# EAGLE design wemos_envir (EAGLE 8.1.1)
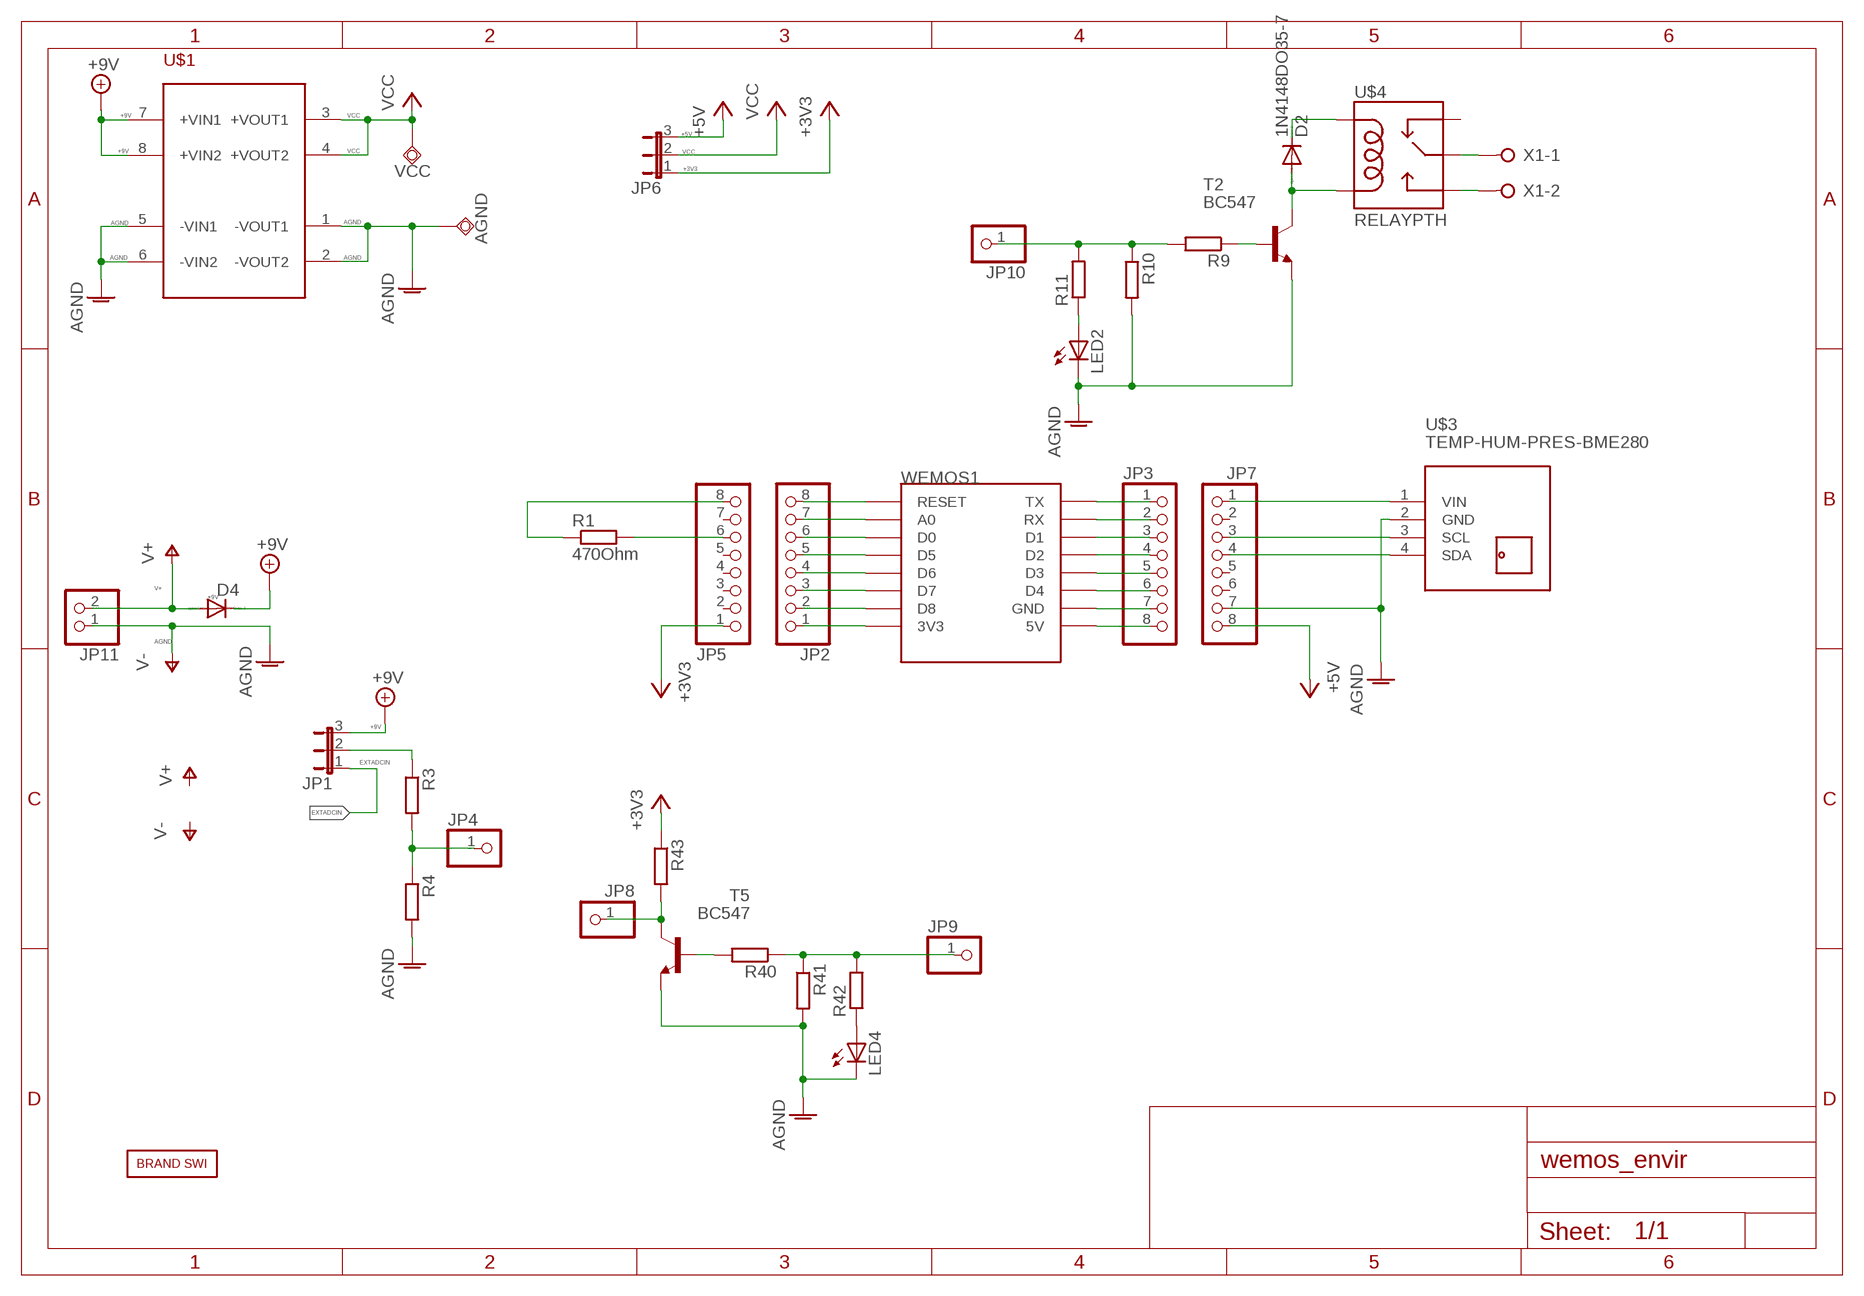
[diagram p0: schematic, sheet 1]

## Parts
AGND  TPSQTP20SQ  [TP20SQ]
D2  1N4148DO35-7  [DO35-7]
D4  1N4148DO35-7  [DO35-7]
JP1  JP2E  [JP2]
JP2  PINHD-1X8  [1X08]
JP3  PINHD-1X8  [1X08]
JP4  PINHD-1X1  [1X01]
JP5  PINHD-1X8  [1X08]
JP6  JP2E  [JP2]
JP7  PINHD-1X8  [1X08]
JP8  PINHD-1X1  [1X01]
JP9  PINHD-1X1  [1X01]
JP10  PINHD-1X1  [1X01]
JP11  PINHD-1X2  [1X02]
LED2  LEDCHIP-LED0805  [CHIP-LED0805]
LED4  LEDCHIP-LED0805  [CHIP-LED0805]
R1  470Ohm  R-EU_R0805  [R0805]
R3  R-EU_R0805  [R0805]
R4  R-EU_R0805  [R0805]
R9  R-EU_R0805  [R0805]
R10  R-EU_R0805  [R0805]
R11  R-EU_R0805  [R0805]
R40  R-EU_R0805  [R0805]
R41  R-EU_R0805  [R0805]
R42  R-EU_R0805  [R0805]
R43  R-EU_R0805  [R0805]
T2  BC547  [TO92]
T5  BC547  [TO92]
U$1  LVPS  [LVPS]
U$2  BRAND_SWI5X7  [BRAND_SWI_5X7]
U$3  TEMP-HUM-PRES-BME280  [TEMP-HUM-PRES-BME280]
U$4  RELAYPTH  [SRD-05VDC-SL-C]
VCC  TPSQTP20SQ  [TP20SQ]
WEMOS1  WEMOS-D1-MINI  [WEMOS-D1-MINI]
X1  W237-02P  [W237-132]

## Nets
+3V3: JP5.1 JP6.1 R43.1
+5V: JP6.3 JP7.8
+9V: D4.C JP1.3 U$1.7(+VIN1) U$1.8(+VIN2)
ADCIN: JP4.1 R3.2 R4.1
AGND: AGND.TP JP7.7 JP11.1 LED2.C LED4.C R4.2 R10.2 R41.2 T2.1(E) T5.1(E) U$1.2(-VOUT2) U$1.5(-VIN1) U$1.6(-VIN2) U$3.2(GND) ; supply symbol labelled V-
EXTADCIN: JP1.1
N$1: JP1.2 R3.1
N$2: JP5.6 R1.2
N$3: D2.C U$4.COIL1
N$4: D2.A T2.3(C) U$4.COIL0
N$5: R9.1 T2.2(B)
N$6: JP10.1 R9.2 R10.1 R11.2
N$7: LED2.A R11.1
N$8: U$4.SWOPEN X1.2
N$9: U$4.SWCOMMON X1.1
N$10: JP5.8 R1.1
N$11: JP2.7 WEMOS1.A0
N$12: JP2.8 WEMOS1.RESET
N$13: JP2.6 WEMOS1.D0
N$14: JP2.5 WEMOS1.D5
N$15: JP2.4 WEMOS1.D6
N$16: JP2.3 WEMOS1.D7
N$17: JP2.2 WEMOS1.D8
N$18: JP2.1 WEMOS1.3V3
N$19: JP3.3 WEMOS1.D1
N$20: JP3.4 WEMOS1.D2
N$21: JP3.1 WEMOS1.TX
N$22: JP3.2 WEMOS1.RX
N$23: JP3.6 WEMOS1.D4
N$24: JP3.7 WEMOS1.GND
N$25: JP3.8 WEMOS1.5V
N$26: JP3.5 WEMOS1.D3
N$27: R40.2 T5.2(B)
N$28: JP7.1 U$3.1(VIN)
N$31: LED4.A R42.1
PCTRL: JP9.1 R40.1 R41.1 R42.2
PVIN: JP8.1 R43.2 T5.3(C)
SCA: JP7.4 U$3.4(SDA)
SCL: JP7.3 U$3.3(SCL)
V+: D4.A JP11.2
VCC: JP6.2 U$1.3(+VOUT1) U$1.4(+VOUT2) VCC.TP
Unconnected: JP5.2 JP5.3 JP5.4 JP5.5 JP5.7 JP7.2 JP7.5 JP7.6 U$1.1(-VOUT1) U$4.SWCLOSED(SWCLOSE)

## Library data of the parts
AGND VCC = testpad:TPSQ: Test pad
D2 D4 = diode:1N4148: DIODE high speed (Philips)
JP1 JP6 = jumper:JP2E: JUMPER
JP2 JP3 JP5 JP7 = pinhead:PINHD-1X8: PIN HEADER
JP4 JP8-JP10 = pinhead:PINHD-1X1: PIN HEADER
JP11 = pinhead:PINHD-1X2: PIN HEADER
LED2 LED4 = led:LED: LED OSRAM: - CHIPLED LG R971, LG N971, LY N971, LG Q971, LY Q971, LO R971, LY R971 LH N974, LH R974 LS Q976, LO Q976, LY Q976 LO Q996 - Hyper CHIPLED LW Q18S LB Q993, LB Q99A, LB R99A - SideLED LS A670, LO A670, LY A670, LG A670, LP A670 LB A673, LV A673, LT A673, LW A673 LH A674 LY A675 LS A676, LA A676, LO A676, LY A676, LW A676 LS A679, LY A679, LG A679 - Hyper Micro SIDELED® LS Y876, LA Y876, LO Y876, LY Y876 LT Y87S - SmartLED LW L88C, LW L88S LB L89C, LB L89S, LG L890 LS L89K, LO L89K, LY L89K LS L896, LA L896, LO L896, LY L896 - TOPLED LS T670, LO T670, LY T670, LG T670, LP T670 LSG T670, LSP T670, LSY T670, LOP T670, LYG T670 LG T671, LOG T671, LSG T671 LB T673, LV T673, LT T673, LW T673 LH T674 LS T676, LA T676, LO T676, LY T676, LB T676, LH T676, LSB T676, LW T676 LB T67C, LV T67C, LT T67C, LS T67K, LO T67K, LY T67K, LW E67C LS E67B, LA E67B, LO E67B, LY E67B, LB E67C, LV E67C, LT E67C LW T67C LS T679, LY T679, LG T679 LS T770, LO T770, LY T770, LG T770, LP T770 LB T773, LV T773, LT T773, LW T773 LH T774 LS E675, LA E675, LY E675, LS T675 LS T776, LA T776, LO T776, LY T776, LB T776 LHGB T686 LT T68C, LB T68C - Hyper Mini TOPLED® LB M676 - Mini TOPLED Santana® LG M470 LS M47K, LO M47K, LY M47K Source: http://www.osram.convergy.de LUXEON: - LUMILED® LXK2-PW12-R00, LXK2-PW12-S00, LXK2-PW14-U00, LXK2-PW14-V00 LXK2-PM12-R00, LXK2-PM12-S00, LXK2-PM14-U00 LXK2-PE12-Q00, LXK2-PE12-R00, LXK2-PE12-S00, LXK2-PE14-T00, LXK2-PE14-U00 LXK2-PB12-K00, LXK2-PB12-L00, LXK2-PB12-M00, LXK2-PB14-N00, LXK2-PB14-P00, LXK2-PB14-Q00 LXK2-PR12-L00, LXK2-PR12-M00, LXK2-PR14-Q00, LXK2-PR14-R00 LXK2-PD12-Q00, LXK2-PD12-R00, LXK2-PD12-S00 LXK2-PH12-R00, LXK2-PH12-S00 LXK2-PL12-P00, LXK2-PL12-Q00, LXK2-PL12-R00 Source: www.luxeon.com KINGBRIGHT: KA-3528ASYC Source: www.kingbright.com
R1 R3 R4 R9-R11 R40-R43 = rcl:R-EU_: RESISTOR, European symbol
T2 T5 = transistor:BC547: NPN TRANSISTOR
U$1 = SWI_COMMONS:LVPS: Low Voltage Power Supply
U$2 = BRAND_SWI:BRAND_SWI
U$3 = diy-modules:TEMP-HUM-PRES-BME280: Digital Humidity-Temperature-Pressure Sensor based on BME280 device More information about BME280 device is available here: https://www.bosch-sensortec.com/bst/products/all_products/bme280 Click here to find device on ebay.com <http://www.ebay.com/sch/bme280+breakout>
U$4 = SWI_COMMONS:RELAY: SPDT relay (COM-00101)
WEMOS1 = SWI_COMMONS:WEMOS-D1-MINI: WeMos.cc D1 mini ESP8266 module
X1 = con-wago-508:W237-02P: WAGO SREW CLAMP; OC_FARNELL: unknown; OC_NEWARK: unknown

## Board
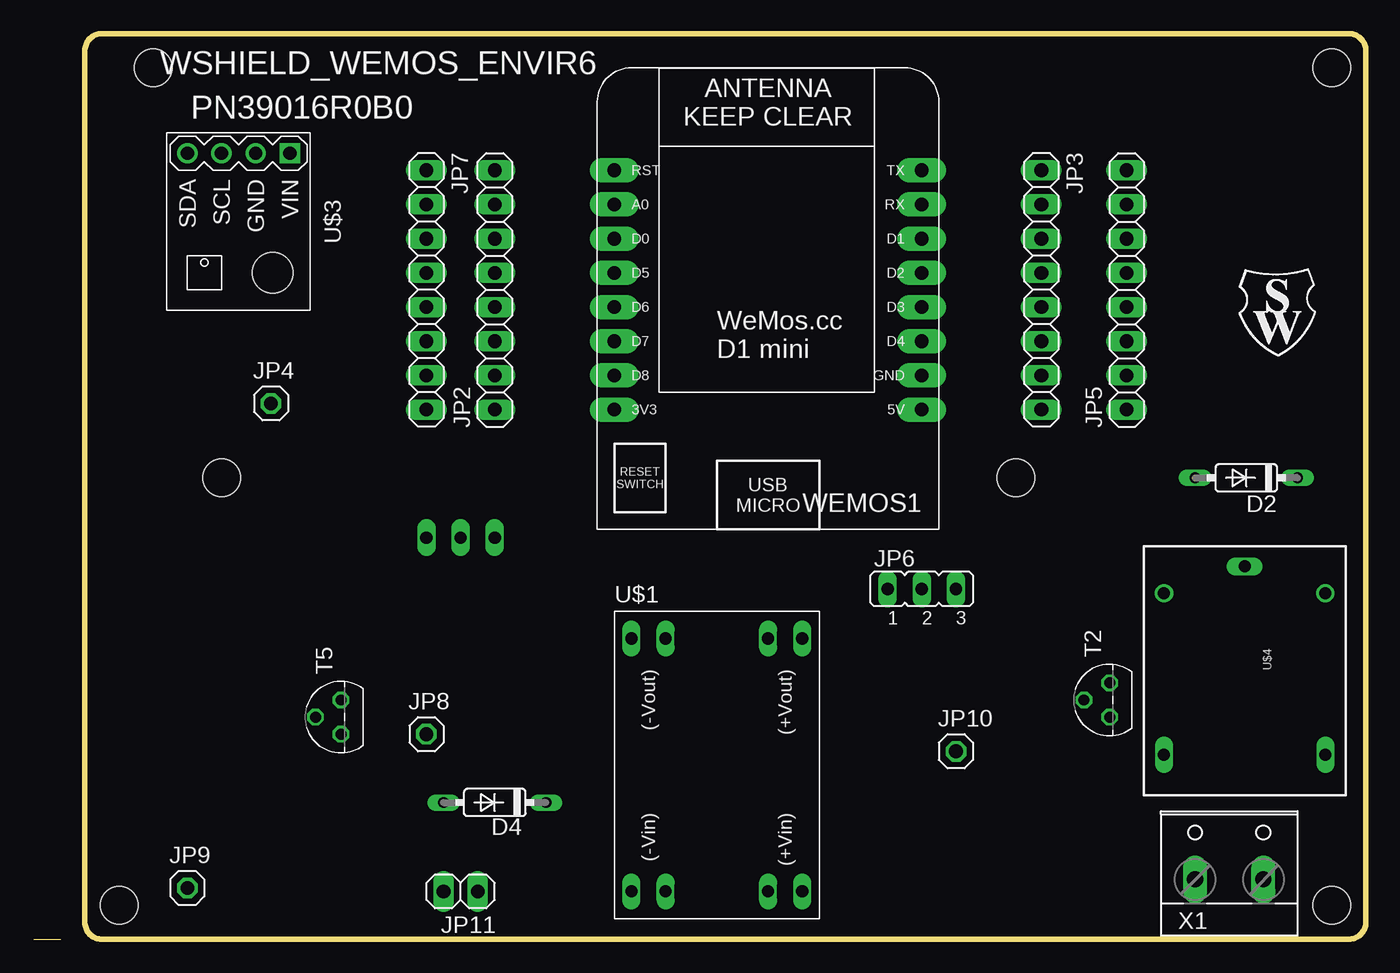
[diagram p1: board, top side]
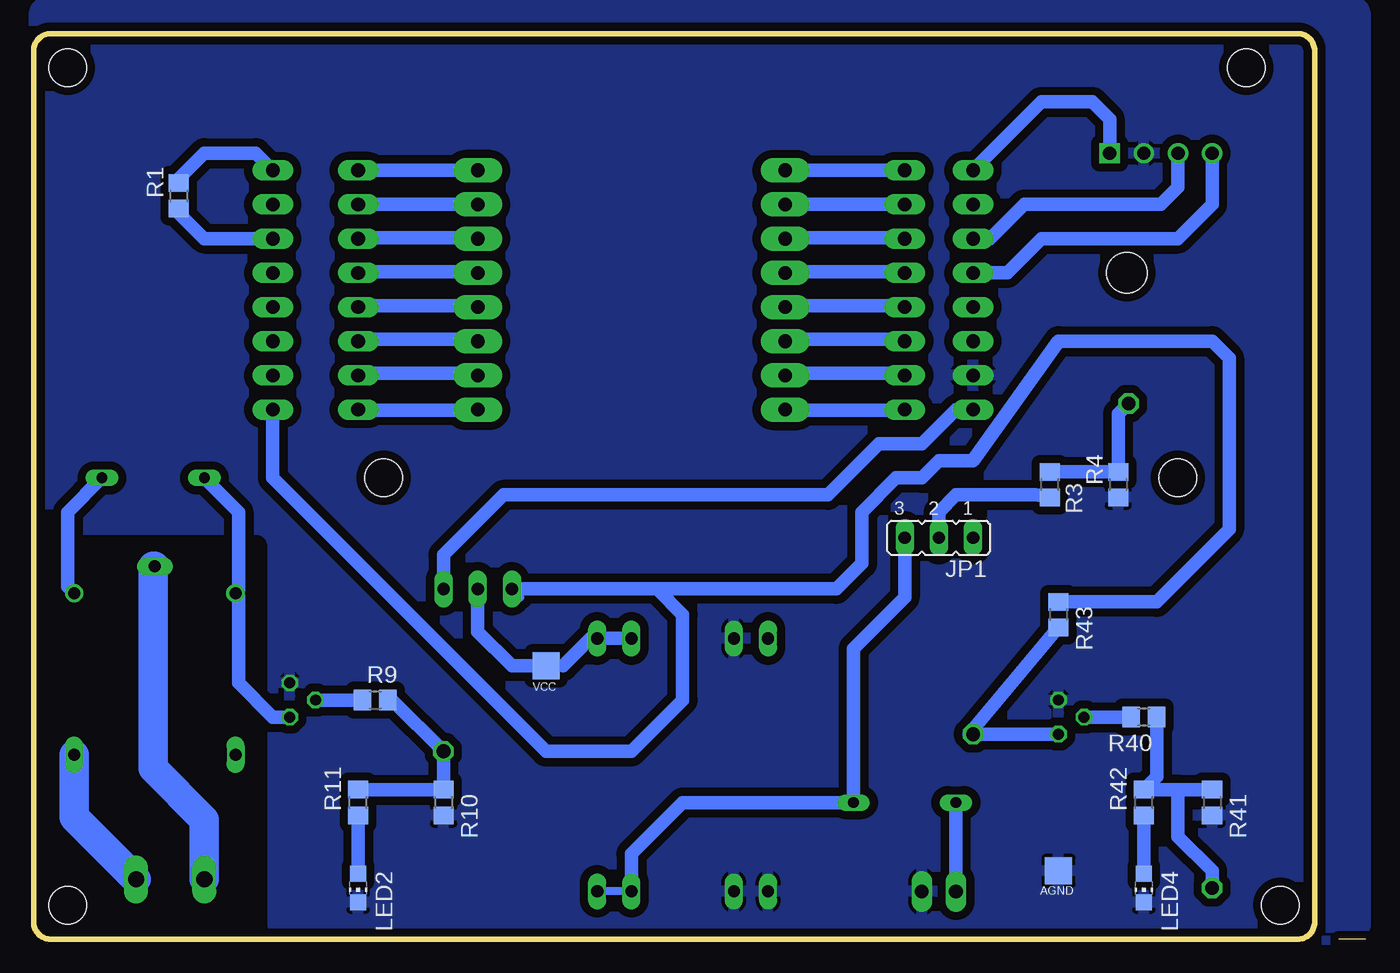
[diagram p2: board, bottom side, seen from below]

Size 99.06 x 67.31 mm. Coordinates in mm from the lower left corner, seen from the top.
Outline: 0,0 2.03,0
Outline: 28.45,0 31.42,0
Outline: 3.81,1.27 3.81,66.04 arc-90 5.08,67.31 97.79,67.31 arc-90 99.06,66.04 99.06,1.27 arc-90 97.79,0 5.08,0 arc-90 3.81,1.27
Copper layers (1*16): Top 0.035mm / dielectric 1.6mm / Bottom 0.035mm
Design rules "Elecrow_2-layer_PCB_eagle_rule *": minimum track width 12mil, minimum drill 12mil, track to track 6mil, track to pad 6mil, pad to pad 6mil, via to via 8mil, smd to smd 0mil, copper to edge 20mil, drill to drill 10mil, minimum pad ring 6mil, minimum via ring 6mil, stop-mask expansion 0mil, vias tented up to drill 100mil, thermal gap 10mil
Holes 2.8 mm at 8.89,64.77 73.03,34.29 6.35,2.54 96.52,64.77 96.52,2.54 13.97,34.29

### Footprints (pad centres in the part's own frame; a part is rotated, then mirrored left to right if it is on the bottom)
TP20SQ = smd 2 x 2: TP 0,0
DO35-7 = drill 0.813 long: A 3.81,0; C -3.81,0
JP2 = drill 0.914 long: 1 -2.54,0; 2 0,0; 3 2.54,0
1X08 = drill 1.016 long: 1 -8.89,0; 2 -6.35,0; 3 -3.81,0; 4 -1.27,0; 5 1.27,0; 6 3.81,0; 7 6.35,0; 8 8.89,0
1X01 = drill 1.016 octagon: 1 0,0
1X02 = drill 1.016 long: 1 -1.27,0; 2 1.27,0
CHIP-LED0805 = smd 1.2 x 1.2: A 0,-1.05; C 0,1.05
R0805 = smd 1.3 x 1.5: 1 -0.95,0; 2 0.95,0
TO92 = drill 0.813 octagon: 1 1.27,0; 2 0,1.905; 3 -1.27,0
LVPS = drill 0.9 long: 1 -6.35,9.4; 2 -3.81,9.4; 3 3.81,9.4; 4 6.35,9.4; 5 -6.35,-9.4; 6 -3.81,-9.4; 7 3.81,-9.4; 8 6.35,-9.4
TEMP-HUM-PRES-BME280 = drill 1 square: 1 -5.08,3.81 | drill 1: 2 -5.08,1.27; 3 -5.08,-1.27; 4 -5.08,-3.81 | hole 3: 3.81,2.54
SRD-05VDC-SL-C = drill 0.9: COIL0 -5.39,-6.12; COIL1 -5.39,5.88 | drill 0.9 long: SWCLOSED 6.61,-6.12; SWCOMMON -7.39,-0.12; SWOPEN 6.61,5.88
WEMOS-D1-MINI = drill 1.016 pad 1.829 long: 3V3 -10.16,-10.16; 5V 12.7,-10.16; A0 -10.16,5.08; D0 -10.16,2.54; D1 12.7,2.54; D2 12.7,0; D3 12.7,-2.54; D4 12.7,-5.08; D5 -10.16,0; D6 -10.16,-2.54; D7 -10.16,-5.08; D8 -10.16,-7.62; GND 12.7,-7.62; RESET -10.16,7.62; RX 12.7,5.08; TX 12.7,7.62
W237-132 = drill 1.194 long: 1 -2.54,-0.635; 2 2.54,-0.635

### Placement (x,y rotation side)
AGND  22.86,5.08 270 bottom
D2  90.17,34.29 180 top
D4  34.29,10.16 180 top
JP1  31.75,29.84 180 bottom
JP2  34.29,48.26 90 top
JP3  74.93,48.26 270 top
JP4  17.65,39.83 0 top
JP5  81.28,48.26 90 top
JP6  66.04,26.04 0 top
JP7  29.21,48.26 270 top
JP8  29.21,15.24 0 top
JP9  11.43,3.81 0 top
JP10  68.58,13.97 0 top
JP11  31.75,3.56 180 top
LED2  74.93,3.81 180 bottom
LED4  16.51,3.81 180 bottom
R1  88.27,55.24 270 bottom
R3  23.5,33.78 90 bottom
R4  18.41,33.78 270 bottom
R9  73.66,17.78 0 bottom
R10  68.58,10.16 270 bottom
R11  74.93,10.16 90 bottom
R40  16.51,16.51 180 bottom
R41  11.43,10.16 270 bottom
R42  16.51,10.16 90 bottom
R43  22.86,24.13 270 bottom
T2  80.01,17.78 90 top
T5  22.86,16.51 90 top
U$1  50.8,12.95 0 top
U$2  89.41,43.18 0 top
U$3  15.24,53.34 270 top
U$4  90.17,20.32 270 top
VCC  60.96,20.32 270 bottom
WEMOS1  53.34,49.53 0 top
X1  88.9,5.08 0 top

### Tracks (layer width: path | path; a pad name or v marks a point on that pad's centre or on a via)
+3V3
  Bottom 0.61: 62.87,25.4 JP6.1
  Bottom 1.016: JP5.1 81.28,34.29 60.96,13.97 54.61,13.97 50.8,17.78 50.8,24.13 52.7,26.04 | 52.7,26.04 JP6.1 | R43.1 15.56,25.08 10.16,30.48 10.16,43.18 11.43,44.45 22.86,44.45 29.21,35.56 31.75,35.56 33.02,34.29 34.92,34.29 37.47,31.75 37.47,27.94 39.37,26.04 52.7,26.04
+5V
  Bottom 1.016: JP7.8 30.48,39.37 33.02,36.83 36.2,36.83 40.01,33.02 64.14,33.02 68.58,28.57 JP6.3
+9V
  Bottom 0.61: U$1.7 U$1.8
  Bottom 1.016: JP1.3 34.29,25.4 38.1,21.59 D4.C 50.8,10.16 54.61,6.35 U$1.7
ADCIN
  Bottom 1.016: R3.2 R4.1 18.41,39.06 JP4.1
AGND
  pour Bottom (isolate 0.61): 0,68.58 arc-90 1.27,69.85 3.81,69.85 97.79,69.85 arc-90 99.06,68.58 99.06,66.04 99.06,31.75 arc-90 97.79,30.48 96.52,30.48 82.55,30.48 arc90 81.28,29.21 81.28,1.27 arc-90 80.01,0 77.47,0 1.27,0 arc-90 0,1.27
N$1
  Bottom 1.016: JP1.2 31.75,31.75 30.48,33.02 24.58,33.02 R3.1
N$2
  Bottom 0.61: R1.2 88.27,53.98
  Bottom 1.016: 88.27,53.98 86.36,52.07 JP5.6
N$3
  Bottom 1.016: D2.C 96.52,31.75 96.52,26.18 U$4.COIL1
N$4
  Bottom 0.61: 83.82,25.94 U$4.COIL0 83.82,25.48
  Bottom 1.016: D2.A 83.82,31.75 83.82,25.94 | T2.3 81.28,16.51 83.82,19.05 83.82,25.48
N$5
  Bottom 1.016: T2.2 R9.1
N$6
  Bottom 1.016: R9.2 72.39,17.78 JP10.1 R10.1 R11.2
N$7
  Bottom 1.016: R11.1 LED2.A
N$8
  Bottom 2.184: U$4.SWOPEN 96.05,9.05 X1.2
N$9
  Bottom 2.184: U$4.SWCOMMON 90.17,27.71 90.17,12.7 86.36,8.89 X1.1
N$10
  Bottom 0.61: R1.1 88.27,56.52
  Bottom 1.016: 88.27,56.52 86.36,58.42 82.55,58.42 JP5.8
N$11
  Bottom 0.305: 34.29,54.63 JP2.7 | 42.98,54.63 WEMOS1.A0
  Bottom 1.016: 42.98,54.63 34.29,54.63
N$12
  Bottom 1.016: WEMOS1.RESET JP2.8
N$13
  Bottom 0.305: 34.29,52.12 JP2.6 | 42.98,52.12 WEMOS1.D0
  Bottom 1.016: 42.98,52.12 34.29,52.12
N$14
  Bottom 0.305: 34.29,49.61 JP2.5 | 42.98,49.61 WEMOS1.D5
  Bottom 1.016: 42.98,49.61 34.29,49.61
N$15
  Bottom 0.305: 34.29,47.09 JP2.4 | 42.98,47.09 WEMOS1.D6
  Bottom 1.016: 42.98,47.09 34.29,47.09
N$16
  Bottom 0.305: 34.29,44.58 JP2.3 | 42.98,44.58 WEMOS1.D7
  Bottom 1.016: 42.98,44.58 34.29,44.58
N$17
  Bottom 0.305: 34.29,42.06 JP2.2 | 42.98,42.06 WEMOS1.D8
  Bottom 1.016: 42.98,42.06 34.29,42.06
N$18
  Bottom 0.305: 34.29,39.32 JP2.1 | 42.98,39.32 WEMOS1.3V3
  Bottom 1.016: 42.98,39.32 34.29,39.32
N$19
  Bottom 0.305: 74.75,52.12 JP3.3 | 66.06,52.12 WEMOS1.D1
  Bottom 1.016: 66.06,52.12 74.75,52.12
N$20
  Bottom 0.305: 74.75,49.61 JP3.4 | 66.06,49.61 WEMOS1.D2
  Bottom 1.016: 66.06,49.61 74.75,49.61
N$21
  Bottom 1.016: WEMOS1.TX JP3.1
N$22
  Bottom 0.305: 74.75,54.63 JP3.2 | 66.06,54.63 WEMOS1.RX
  Bottom 1.016: 66.06,54.63 74.75,54.63
N$23
  Bottom 0.305: 74.75,44.58 JP3.6 | 66.06,44.58 WEMOS1.D4
  Bottom 1.016: 66.06,44.58 74.75,44.58
N$24
  Bottom 0.305: 74.75,42.06 JP3.7 | 66.06,42.06 WEMOS1.GND
  Bottom 1.016: 66.06,42.06 74.75,42.06
N$25
  Bottom 0.305: 74.75,39.32 JP3.8 | 66.06,39.32 WEMOS1.5V
  Bottom 1.016: 66.06,39.32 74.75,39.32
N$26
  Bottom 0.305: 74.75,47.09 JP3.5 | 66.06,47.09 WEMOS1.D3
  Bottom 1.016: 66.06,47.09 74.75,47.09
N$27
  Bottom 1.016: T5.2 R40.2
N$28
  Bottom 1.016: JP7.1 24.13,62.23 20.32,62.23 19.05,60.96 U$3.1
N$31
  Bottom 1.016: LED4.A R42.1
PCTRL
  Bottom 1.016: R40.1 15.56,12.06 R42.2 13.97,11.11 | 13.97,11.11 R41.1 | JP9.1 11.43,5.08 13.97,7.62 13.97,11.11
PVIN
  Bottom 0.61: JP8.1 29.53,15.24
  Bottom 1.016: 29.53,15.24 R43.2 | JP8.1 T5.3
SCA
  Bottom 1.016: JP7.4 26.67,49.53 24.13,52.07 13.97,52.07 11.43,54.61 U$3.4
SCL
  Bottom 1.016: JP7.3 27.94,52.07 25.4,54.61 15.24,54.61 13.97,55.88 U$3.3
V+
  Bottom 1.016: JP11.2 D4.A
VCC
  Bottom 0.61: U$1.4 57.66,22.35 | VCC.TP 59.69,20.32
  Bottom 1.016: U$1.3 U$1.4 | 57.66,22.35 59.69,20.32 | JP6.2 66.04,22.86 63.5,20.32 VCC.TP

### Text on the board
tNames: WSHIELD_WEMOS_ENVIR6 | PN39016R0B0